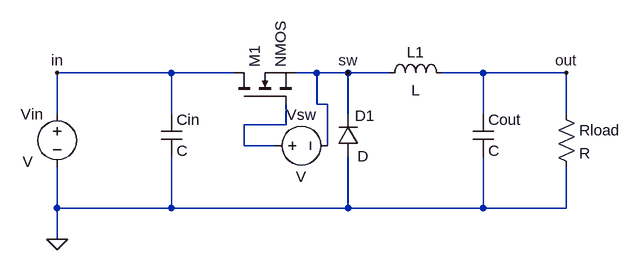
[diagram p0: schematic Buck_converter_async.asc]
Buck_converter_async.asc, the LTspice schematic file:
Version 4
SHEET 1 880 680
WIRE 64 128 -112 128
WIRE 160 128 64 128
WIRE 288 128 256 128
WIRE 336 128 288 128
WIRE 400 128 336 128
WIRE 544 128 480 128
WIRE 672 128 544 128
WIRE 288 176 288 128
WIRE 304 176 288 176
WIRE -112 192 -112 128
WIRE 64 192 64 128
WIRE 336 192 336 128
WIRE 544 192 544 128
WIRE 672 192 672 128
WIRE 240 208 240 176
WIRE 240 208 176 208
WIRE 176 240 176 208
WIRE 224 240 176 240
WIRE 304 240 304 176
WIRE -112 336 -112 272
WIRE 64 336 64 256
WIRE 64 336 -112 336
WIRE 336 336 336 256
WIRE 336 336 64 336
WIRE 544 336 544 256
WIRE 544 336 336 336
WIRE 672 336 672 272
WIRE 672 336 544 336
WIRE -112 384 -112 336
FLAG -112 384 0
FLAG 336 128 sw
FLAG -112 128 in
FLAG 672 128 out
SYMBOL voltage -112 176 R0
WINDOW 0 -56 16 Left 2
WINDOW 3 -53 89 Left 2
SYMATTR InstName Vin
SYMBOL cap 48 192 R0
SYMATTR InstName Cin
SYMBOL cap 528 192 R0
SYMATTR InstName Cout
SYMBOL diode 352 256 R180
WINDOW 0 -25 62 Left 2
WINDOW 3 -16 0 Left 2
SYMATTR InstName D1
SYMBOL ind 384 144 R270
WINDOW 0 32 56 VTop 2
WINDOW 3 5 56 VBottom 2
SYMATTR InstName L1
SYMBOL nmos 160 176 R270
SYMATTR InstName M1
SYMBOL res 656 176 R0
SYMATTR InstName Rload
SYMBOL voltage 208 240 R270
WINDOW 0 32 56 VTop 2
WINDOW 3 -32 56 VBottom 2
SYMATTR InstName Vsw

The netlist it stands for:
* Buck_converter_async.asc
Vin in 0 V
Cin in 0 C
Cout out 0 C
D1 0 sw D
L1 sw out L
M1 in N001 sw sw NMOS
Rload out 0 R
Vsw N001 sw V
.model D D
.lib standard.dio
.model NMOS NMOS
.model PMOS PMOS
.lib standard.mos
.backanno
.end